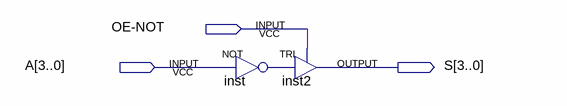
[diagram p0: schematic sheet]
// Quartus schematic NOT_4.bdf as structural Verilog: 2 symbols, 3 pins
module NOT_4 (
  input  \OE-NOT ,
  input  [3:0] A,
  output [3:0] S
);

  wire inst_out;

  assign inst_out = ~A;  // NOT inst, 4 bits wide
  TRI inst2[3:0] (.IN(inst_out), .OE(\OE-NOT ), .OUT(S));
endmodule
